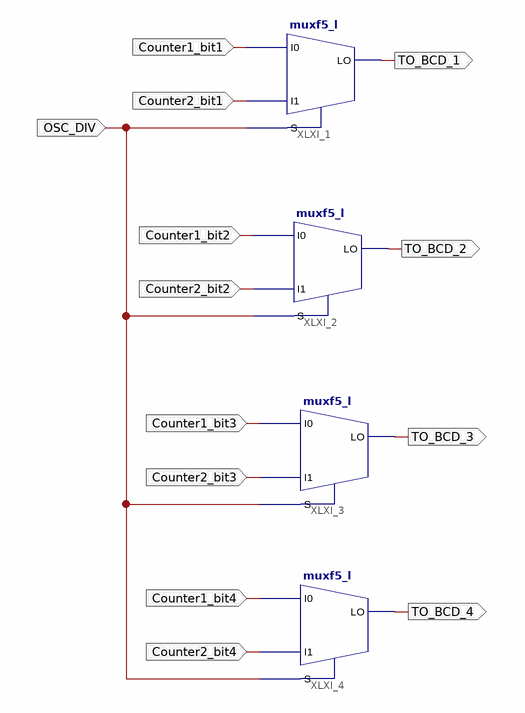
[diagram p0: schematic sheet 1]
// Xilinx ISE schematic Mutilplexer.sch (spartan6) as structural Verilog: 4 symbols, 13 ports
module Mutilplexer (
  input  OSC_DIV,
  input  Counter1_bit1,
  input  Counter2_bit1,
  input  Counter1_bit2,
  input  Counter2_bit2,
  input  Counter1_bit3,
  input  Counter2_bit3,
  input  Counter1_bit4,
  input  Counter2_bit4,
  output TO_BCD_1,
  output TO_BCD_2,
  output TO_BCD_3,
  output TO_BCD_4
);

  muxf5_l XLXI_1 (.I0(Counter1_bit1), .I1(Counter2_bit1), .S(OSC_DIV), .LO(TO_BCD_1));
  muxf5_l XLXI_2 (.I0(Counter1_bit2), .I1(Counter2_bit2), .S(OSC_DIV), .LO(TO_BCD_2));
  muxf5_l XLXI_3 (.I0(Counter1_bit3), .I1(Counter2_bit3), .S(OSC_DIV), .LO(TO_BCD_3));
  muxf5_l XLXI_4 (.I0(Counter1_bit4), .I1(Counter2_bit4), .S(OSC_DIV), .LO(TO_BCD_4));
endmodule
